# Altium schematic sheet Main.SchDoc: Breakout 8pin
size A3; Organization: INTERCREATE; Address1: 2415 3RD ST. SUITE #232; Address2: SAN FRANCISCO CA 94107; SheetNumber: 1; SheetTotal: 1; ProjectName: KAGWERKS COMMAND CENTER
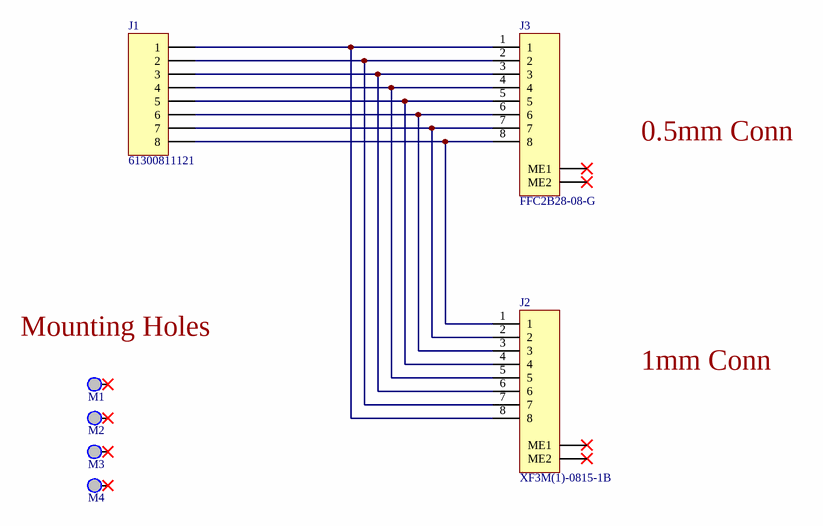
[diagram p0: Main.SchDoc]

## Parts
J1  61300811121  [HDR-V-1X8]
J2  XF3M(1)-0815-1B  [CONN-FFC-H-8P-1MM]
J3  FFC2B28-08-G  [CONN-FFC-H-8P-0.5MM]
M1  MTG_HOLE  [MH_P_2.5MM]  (value not drawn)  (no BOM)
M2  MTG_HOLE  [MH_P_2.5MM]  (value not drawn)  (no BOM)
M3  MTG_HOLE  [MH_P_2.5MM]  (value not drawn)  (no BOM)
M4  MTG_HOLE  [MH_P_2.5MM]  (value not drawn)  (no BOM)

## Nets
NetJ1_1: J1.1 J2.8 J3.1
NetJ1_2: J1.2 J2.7 J3.2
NetJ1_3: J1.3 J2.6 J3.3
NetJ1_4: J1.4 J2.5 J3.4
NetJ1_5: J1.5 J2.4 J3.5
NetJ1_6: J1.6 J2.3 J3.6
NetJ1_7: J1.7 J2.2 J3.7
NetJ1_8: J1.8 J2.1 J3.8

Not connected (* = marked no-connect by the designer): J2 ME1* ME2*; J3 ME1* ME2*; M1 1*; M2 1*; M3 1*; M4 1*

## Notes on the sheet
- 0.5mm Conn
- (near M1) Mounting Holes
- 1mm Conn
- Title
- Size:
- Date:
- A3
- Number:
- Time:
- Revision:
- Sheet
- of
- File:

## Library data of the parts
J1 = HDR-V-1X8-M: THT Vertical Pin Header WR-PHD, Pitch 2.54 mm, Single Row, 8 pins; Manufacturer 1: Wurth Electronics; Number of Positions: 8; Gender: Male; Pitch: 0.1inch; Supplier: Newark; Supplier Part Number: 20X0963; Manufacturer Part Number 1: 61300811121; RoHS: Yes; Category: Headers and Wire Housings; Stock: 1852; Pricing: 1=0.408, 10=0.343, 25=0.286, 50=0.239, 100=0.216 (USD); Mounting Technology: Through Hole; Contact Plating: Gold; Contact Material: Copper; Color: Black; Number of Rows: 1; Packaging: Bulk; Termination: Solder; Number of Contacts: 8; Series: WR-PHD; Contact Type: Male Pin; Contact Mating Length: 0.236inch; RoHS Compliant: Yes; Reach SVHC Compliant: Unknown; ComponentLink1URL: https://datasheet.octopart.com/61300811121-W%C3%BCrth-Elektronik-datasheet-21154836.pdf?src-supplier=Element14; ComponentLink1Description: https://datasheet.octopart.com/61300811121-W%C3%BCrth-Elektronik-datasheet-21154836.pdf?src-supplier=Element14; ComponentLink2URL: https://katalog.we-online.de/em/datasheet/6130xx11121.pdf?src-supplier=Digi-Key; ComponentLink2Description: https://katalog.we-online.de/em/datasheet/6130xx11121.pdf?src-supplier=Digi-Key
J2 = CONN-FFC-H-8P-1MM: 1.0-mm Pitch, Dual Contact ; For FPC/FFC, 8 Contacts, RoHS; Manufacturer 1: Omron; Actuator Material: Polymer,Liquid Crystal Polymer; Actuator Color: Black; Number of Positions: 8; Voltage Rating: 50V; Mating Cycles: 20; Supplier: Arrow Electronics; Supplier Part Number: XF3M(1)-0815-1B; Manufacturer Part Number 1: XF3M(1)-0815-1B; RoHS: Yes; Category: FFC / FPC; Stock: 3000; Pricing: 1500=0.6639, 3000=0.6476, 7500=0.6309, 10500=0.6071, 15000=0.5967 (USD); Mounting Technology: Surface Mount; Pins: 8; Contact Material: Copper Alloy; Contact Plating: Gold; Housing Material: Polymer; Housing Color: Natural; Min Operating Temperature: -30°C; Max Operating Temperature: 85°C; Packaging: Cut Tape; Termination: Solder; Series: XF3M; Flammability Rating: UL94 V-0; RoHS Compliant: Yes; ComponentLink1URL: https://media.digikey.com/pdf/Data%20Sheets/Omron%20PDFs/XF3M.pdf?src-supplier=Digi-Key; ComponentLink1Description: https://media.digikey.com/pdf/Data%20Sheets/Omron%20PDFs/XF3M.pdf?src-supplier=Digi-Key; ComponentLink2URL: http://datasheet.octopart.com/XF3M%281%29-0815-1B-Omron-datasheet-62282188.pdf?src-supplier=Avnet; ComponentLink2Description: http://datasheet.octopart.com/XF3M%281%29-0815-1B-Omron-datasheet-62282188.pdf?src-supplier=Avnet; ComponentLink3URL: http://datasheet.octopart.com/XF3M%281%29-0815-1B-Omron-datasheet-62282188.pdf?src-supplier=Farnell; ComponentLink3Description: http://datasheet.octopart.com/XF3M%281%29-0815-1B-Omron-datasheet-62282188.pdf?src-supplier=Farnell; ComponentLink4URL: http://datasheet.octopart.com/XF3M%281%29-0815-1B-Omron-datasheet-62282188.pdf?src-supplier=Digi-Key; ComponentLink4Description: http://datasheet.octopart.com/XF3M%281%29-0815-1B-Omron-datasheet-62282188.pdf?src-supplier=Digi-Key; ComponentLink5URL: http://datasheet.octopart.com/XF3M%281%29-0815-1B-Omron-datasheet-62282188.pdf?src-supplier=Newark; ComponentLink5Description: http://datasheet.octopart.com/XF3M%281%29-0815-1B-Omron-datasheet-62282188.pdf?src-supplier=Newark; ComponentLink6URL: http://datasheet.octopart.com/XF3M%281%29-0815-1B-Omron-datasheet-62282188.pdf?src-supplier=Verical; ComponentLink6Description: http://datasheet.octopart.com/XF3M%281%29-0815-1B-Omron-datasheet-62282188.pdf?src-supplier=Verical; ComponentLink7URL: http://datasheet.octopart.com/XF3M%281%29-0815-1B-Omron-datasheet-62282188.pdf?src-supplier=Allied+Electronics; ComponentLink7Description: http://datasheet.octopart.com/XF3M%281%29-0815-1B-Omron-datasheet-62282188.pdf?src-supplier=Allied+Electronics; ComponentLink8URL: http://datasheet.octopart.com/XF3M%281%29-0815-1B-Omron-datasheet-62282188.pdf?src-supplier=Onlinecomponents.com; ComponentLink8Description: http://datasheet.octopart.com/XF3M%281%29-0815-1B-Omron-datasheet-62282188.pdf?src-supplier=Onlinecomponents.com; ComponentLink9URL: http://datasheet.octopart.com/XF3M%281%29-0815-1B-Omron-datasheet-62282188.pdf?src-supplier=Mouser; ComponentLink9Description: http://datasheet.octopart.com/XF3M%281%29-0815-1B-Omron-datasheet-62282188.pdf?src-supplier=Mouser; ComponentLink10URL: http://datasheet.octopart.com/XF3M%281%29-0815-1B-Omron-datasheet-62282188.pdf?src-supplier=TTI; ComponentLink10Description: http://datasheet.octopart.com/XF3M%281%29-0815-1B-Omron-datasheet-62282188.pdf?src-supplier=TTI; ComponentLink11URL: http://datasheet.octopart.com/XF3M%281%29-0815-1B-Omron-datasheet-62282188.pdf?src-supplier=Sager+Electronics; ComponentLink11Description: http://datasheet.octopart.com/XF3M%281%29-0815-1B-Omron-datasheet-62282188.pdf?src-supplier=Sager+Electronics; ComponentLink12URL: http://datasheet.octopart.com/XF3M%281%29-0815-1B-Omron-datasheet-62282188.pdf?src-supplier=Heilind+Electronics; ComponentLink12Description: http://datasheet.octopart.com/XF3M%281%29-0815-1B-Omron-datasheet-62282188.pdf?src-supplier=Heilind+Electronics; ComponentLink13URL: https://datasheet.octopart.com/XF3M%281%29-0815-1B-Omron-datasheet-62282188.pdf?src-supplier=Master+Electronics; ComponentLink13Description: https://datasheet.octopart.com/XF3M%281%29-0815-1B-Omron-datasheet-62282188.pdf?src-supplier=Master+Electronics
J3 = CONN-FFC-H-8P-0.5MM: FFC & FPC Connectors 08W, 0.5mm FFC Con, R/A, Dual Cont, B/Flp, H1.0mm, Gld, SMT, T&R; Manufacturer 1: Global Connector Technology; Supplier: Future Electronics; Supplier Part Number: 1163647; Manufacturer Part Number 1: FFC2B28-08-G; RoHS: Yes; Category: Connectors; Stock: 8000; Pricing: 4000=0.163, 8000=0.159, 12000=0.157, 16000=0.155 (USD)
M1-M4 = MTG_HOLE: MTG HOLE PLATED VARIOUS SIZES